# EAGLE design light_v2 (EAGLE 7.2.0)
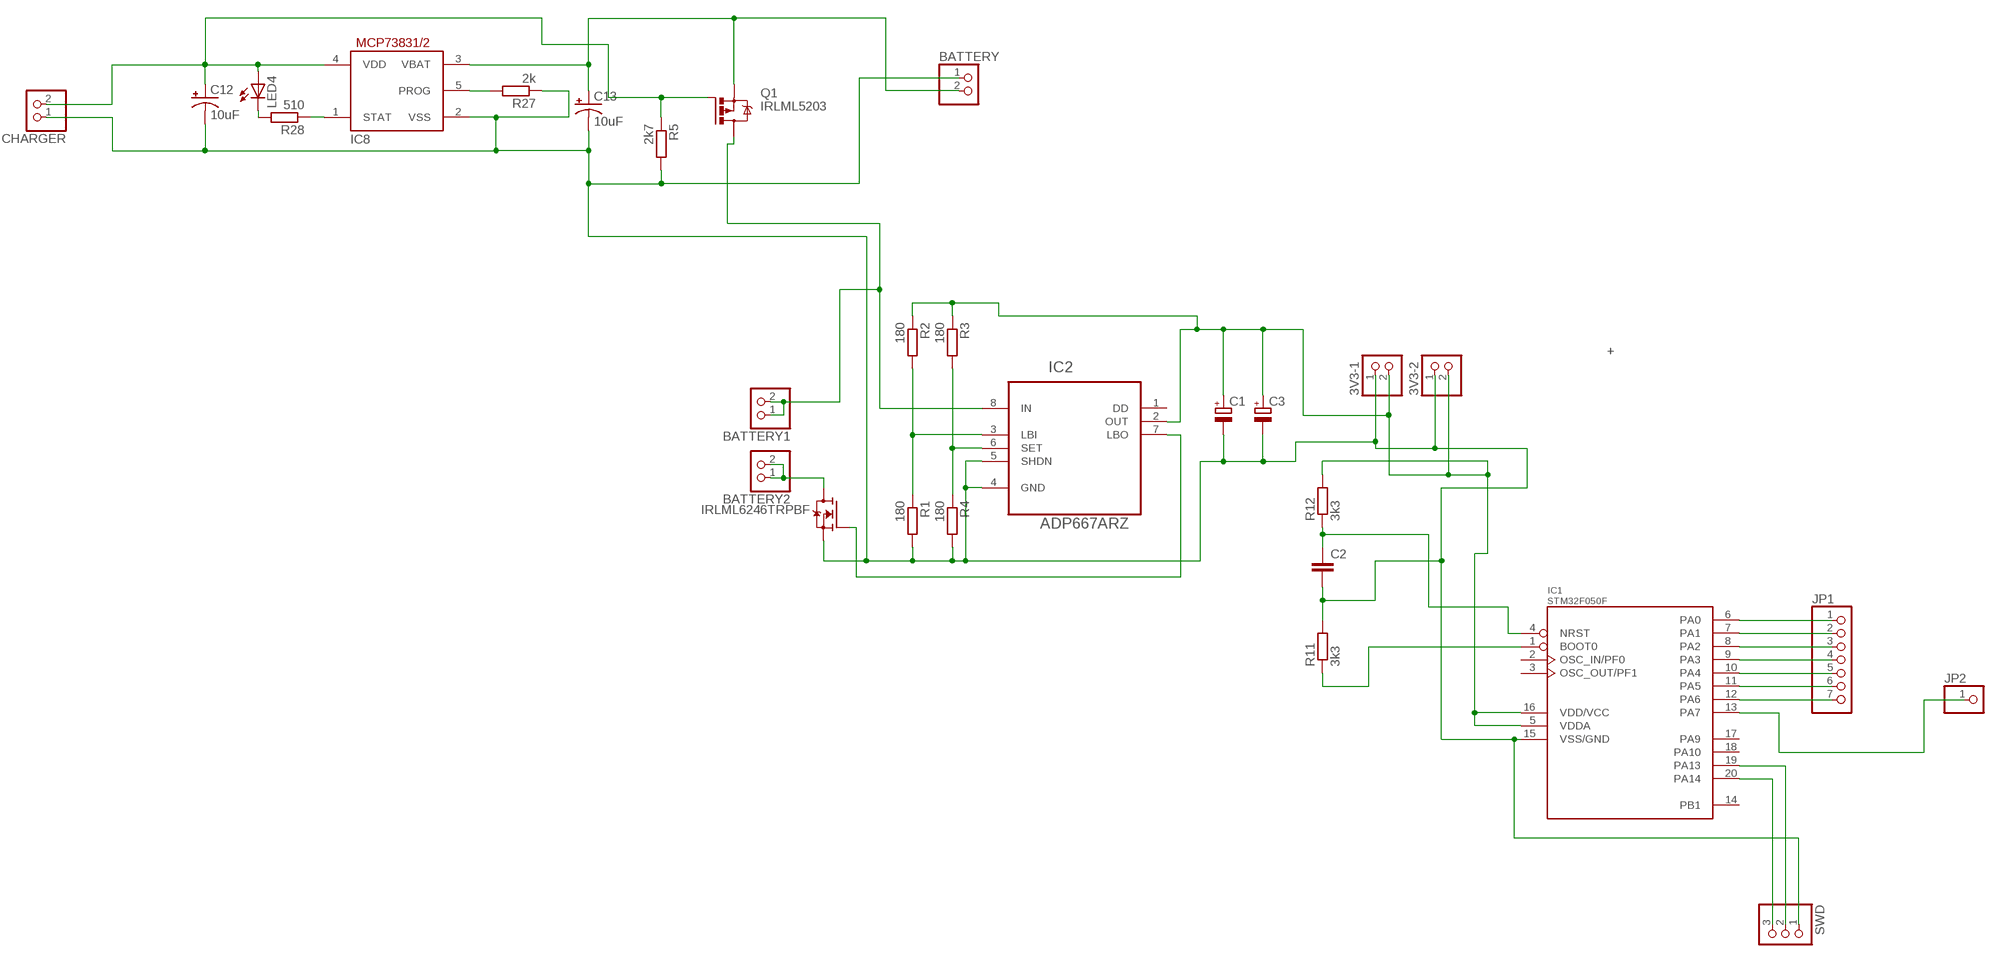
[diagram p0: schematic, sheet 1]

## Parts
3V3-1  PINHD-1X2  [1X02]
3V3-2  PINHD-1X2  [1X02]
BATTERY  PINHD-1X2  [1X02]
BATTERY1  PINHD-1X2  [1X02]
BATTERY2  PINHD-1X2  [1X02]
C1  CPOL-EUSMCD  [SMC_D]
C2  C-EUC1206  [C1206]
C3  CPOL-EUSMCD  [SMC_D]
C12  10uF  CPOL-USSMCD  [SMC_D]
C13  10uF  CPOL-USSMCD  [SMC_D]
CHARGER  PINHD-1X2  [1X02]
IC1  STM32F050F  [TSSOP20]
IC2  ADP667ARZ  [SOIC127P600X175-8N]
IC8  MCP73831/OT  [SOT23-5L]
IRLML6246TRPBF  MOSFET-N-SOT23  [SOT23]
JP1  PINHD-1X7  [1X07]
JP2  PINHD-1X1  [1X01]
LED4  LED  [SMARTLED-TTW]
Q1  IRLML5203  [MICRO3]
R1  180  R-EU_M1206  [M1206]
R2  180  R-EU_M1206  [M1206]
R3  180  R-EU_M1206  [M1206]
R4  180  R-EU_M1206  [M1206]
R5  2k7  R-EU_M1206  [M1206]
R11  3k3  R-EU_M1206  [M1206]
R12  3k3  R-EU_M1206  [M1206]
R27  2k  R-EU_M1206  [M1206]
R28  510  R-EU_M1206  [M1206]
SWD  PINHD-1X3  [1X03]

## Nets
N$1: IC1.6(PA0) JP1.1
N$3: IC1.7(PA1) JP1.2
N$4: IC1.8(PA2) JP1.3
N$5: BATTERY1.1 BATTERY1.2 IC2.8(IN) Q1.3(D)
N$6: IC1.9(PA3) JP1.4
N$7: IC1.10(PA4) JP1.5
N$8: IC1.11(PA5) JP1.6
N$9: IC1.12(PA6) JP1.7
N$10: IC1.13(PA7) JP2.1
N$11: BATTERY2.1 BATTERY2.2 IRLML6246TRPBF.3(D)
N$12: IC2.7(LBO) IRLML6246TRPBF.1(G)
N$15: 3V3-1.1 3V3-2.1 BATTERY.1 C1.- C2.2 C3.- C12.- C13.- CHARGER.1 IC1.15(VSS/GND) IC2.4(GND) IC2.5(SHDN) IC8.2(VSS) IRLML6246TRPBF.2(S) R1.2 R4.2 R5.2 R11.2 R27.1 SWD.1
N$16: BATTERY.2 C13.+ IC8.3(VBAT) Q1.2(S)
N$20: IC2.6(SET) R3.2 R4.1
N$22: IC2.3(LBI) R1.1 R2.2
N$31: C2.1 IC1.4(NRST) R12.1
N$32: IC1.1(BOOT0) R11.1
N$34: IC1.19(PA13) SWD.2
N$35: IC1.20(PA14) SWD.3
N$57: C12.+ CHARGER.2 IC8.4(VDD) LED4.A@1(A) Q1.1(G) R5.1
N$66: IC8.5(PROG) R27.2
N$68: IC8.1(STAT) R28.1
N$70: LED4.C@1(C) R28.2
OUT: 3V3-1.2 3V3-2.2 C1.+ C3.+ IC1.5(VDDA) IC1.16(VDD/VCC) IC2.2(OUT) R2.1 R3.1 R12.2
Unconnected: IC1.2(OSC_IN/PF0) IC1.3(OSC_OUT/PF1) IC1.14(PB1) IC1.17(PA9) IC1.18(PA10) IC2.1(DD)

## Notes on the sheet
- +

## Library data of the parts
3V3-1 3V3-2 BATTERY BATTERY1 BATTERY2 CHARGER = pinhead:PINHD-1X2: PIN HEADER
C1 C3 = resistor:CPOL-EU: POLARIZED CAPACITOR, European symbol
C2 = rcl:C-EU: CAPACITOR, European symbol
C12 C13 = rcl:CPOL-US: POLARIZED CAPACITOR, American symbol
IC1 = STM32F050:STM32F050*: STM32F050xxF*
IC2 = Analog Devices_By_element14_Batch_1:ADP667ARZ: Low-Dropout Linear Voltage Regulator; MPN: ADP667ARZ; OC_FARNELL: -; OC_NEWARK: 59K2649; PACKAGE: SOIC-8; SUPPLIER: Analog Devices
IC8 = adafruit:MCP73831: MCP73831/2 Miniature Single-Cell, Fully Integrated Li-Ion, Li-Polymer Charge Management Controllers. Nice and small simple lipoly charge controller, with adjustable current and status output (LED) http://www.ladyada.net/library/pcb/eaglelibrary.html
IRLML6246TRPBF = we-transistor:MOSFET-N: N-Channel MOSFET TSM3404, IRLML2502 (Vgs>=+/-20V, Vds>=20V, Id>=3A + Rds<=0.05Ohm @ Vgs=4.5V) BSS138 (Vgs>=+/-20V, Vds>=40V, Id>=0.2A + Rds<=3Ohm @ Vgs=4.5V)
JP1 = pinhead:PINHD-1X7: PIN HEADER
JP2 = pinhead:PINHD-1X1: PIN HEADER
LED4 = adafruit:LED: LED OSRAM: - CHIPLED LG R971, LG N971, LY N971, LG Q971, LY Q971, LO R971, LY R971 LH N974, LH R974 LS Q976, LO Q976, LY Q976 LO Q996 - Hyper CHIPLED LW Q18S LB Q993, LB Q99A, LB R99A - SideLED LS A670, LO A670, LY A670, LG A670, LP A670 LB A673, LV A673, LT A673, LW A673 LH A674 LY A675 LS A676, LA A676, LO A676, LY A676, LW A676 LS A679, LY A679, LG A679 - Hyper Micro SIDELED® LS Y876, LA Y876, LO Y876, LY Y876 LT Y87S - SmartLED LW L88C, LW L88S LB L89C, LB L89S, LG L890 LS L89K, LO L89K, LY L89K LS L896, LA L896, LO L896, LY L896 - TOPLED LS T670, LO T670, LY T670, LG T670, LP T670 LSG T670, LSP T670, LSY T670, LOP T670, LYG T670 LG T671, LOG T671, LSG T671 LB T673, LV T673, LT T673, LW T673 LH T674 LS T676, LA T676, LO T676, LY T676, LB T676, LH T676, LSB T676, LW T676 LB T67C, LV T67C, LT T67C, LS T67K, LO T67K, LY T67K, LW E67C LS E67B, LA E67B, LO E67B, LY E67B, LB E67C, LV E67C, LT E67C LW T67C LS T679, LY T679, LG T679 LS T770, LO T770, LY T770, LG T770, LP T770 LB T773, LV T773, LT T773, LW T773 LH T774 LS E675, LA E675, LY E675, LS T675 LS T776, LA T776, LO T776, LY T776, LB T776 LHGB T686 LT T68C, LB T68C - Hyper Mini TOPLED® LB M676 - Mini TOPLED Santana® LG M470 LS M47K, LO M47K, LY M47K Source: http://www.osram.convergy.de/
Q1 = transistor-power:IRLML5203: HEXFET P-Channel Power MOSFET
R1-R5 R11 R12 R27 R28 = resistor:R-EU_: RESISTOR, European symbol
SWD = adafruit:PINHD-1X3: PIN HEADER

## Board
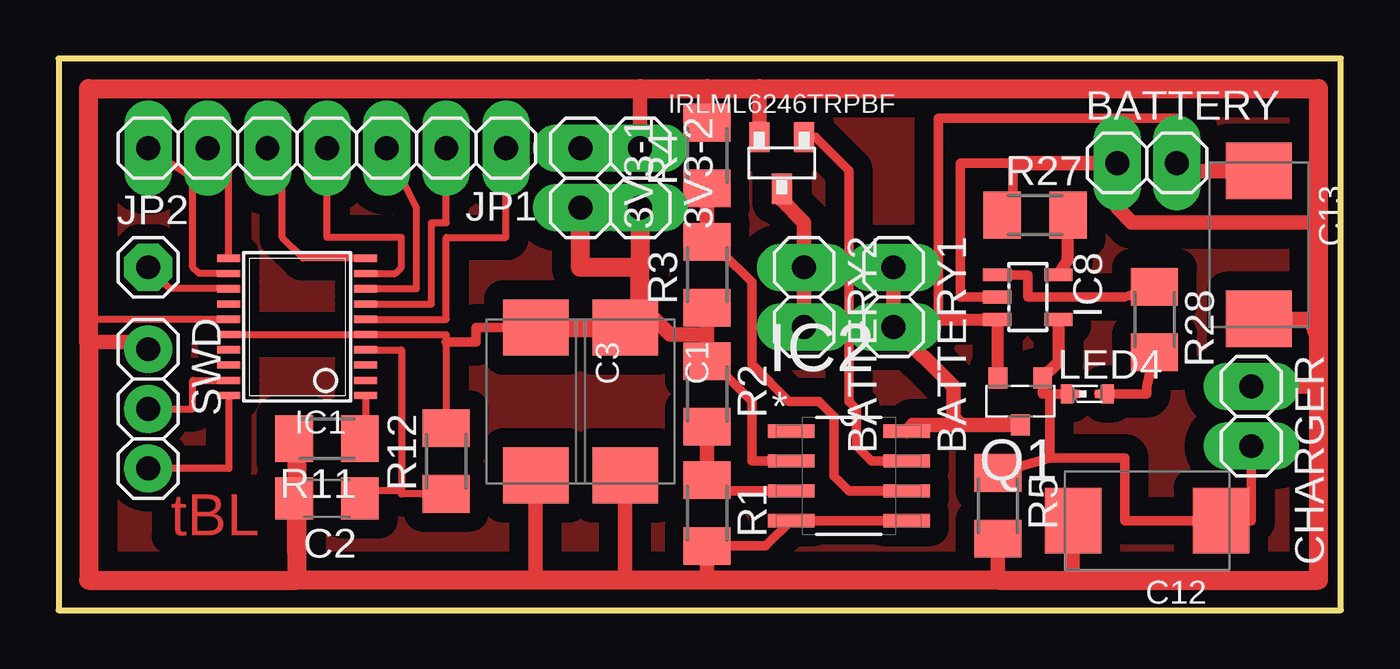
[diagram p1: board, top side]

Size 54.61 x 23.5 mm. Coordinates in mm from the lower left corner, seen from the top.
Outline: 0,0 54.61,0 54.61,23.5 0,23.5 0,0
Copper layers (1*16): Top 0.035mm / dielectric 1.5mm / Bottom 0.035mm
Design rules "default *": minimum track width 10mil, minimum drill 24mil, track to track 8mil, track to pad 8mil, pad to pad 8mil, via to via 8mil, smd to smd 8mil, copper to edge 40mil, drill to drill 8mil, minimum pad ring 20mil, minimum via ring 15mil, stop-mask expansion 4mil, vias tented up to drill 0mil, thermal gap 10mil

### Footprints (pad centres in the part's own frame; a part is rotated, then mirrored left to right if it is on the bottom)
1X02 = drill 1.016 long: 1 -1.27,0; 2 1.27,0
SMC_D = smd 2.4 x 2.8: + -3.15,0; - 3.15,0
C1206 = smd 1.6 x 1.8: 1 -1.4,0; 2 1.4,0
TSSOP20 = smd 0.305 x 0.991: 1 -2.925,-2.918; 2 -2.275,-2.918; 3 -1.625,-2.918; 4 -0.975,-2.918; 5 -0.325,-2.918; 6 0.325,-2.918; 7 0.975,-2.918; 8 1.625,-2.918; 9 2.275,-2.918; 10 2.925,-2.918; 11 2.925,2.918; 12 2.275,2.918; 13 1.625,2.918; 14 0.975,2.918; 15 0.325,2.918; 16 -0.325,2.918; 17 -0.975,2.918; 18 -1.625,2.918; 19 -2.275,2.918; 20 -2.925,2.918
SOIC127P600X175-8N = smd 1.981 x 0.559: 1 -2.464,1.905; 2 -2.464,0.635; 3 -2.464,-0.635; 4 -2.464,-1.905; 5 2.464,-1.905; 6 2.464,-0.635; 7 2.464,0.635; 8 2.464,1.905
SOT23-5L = smd 0.55 x 1.2: 1 -0.95,-1.3; 2 0,-1.3; 3 0.95,-1.3; 4 0.95,1.3; 5 -0.95,1.3
SOT23 = smd 1.3 x 0.9: 1 -1.1,0.95; 2 -1.1,-0.95; 3 1.1,0
1X07 = drill 1.016 long: 1 -7.62,0; 2 -5.08,0; 3 -2.54,0; 4 0,0; 5 2.54,0; 6 5.08,0; 7 7.62,0
1X01 = drill 1.016 octagon: 1 0,0
SMARTLED-TTW = smd 0.8 x 0.5: A 0,-0.875; C 0,0.875 | smd 0.35 x 0.35: A@1 0,-0.5; C@1 0,0.5
MICRO3 = smd 0.8 x 0.9: 1 -0.95,-1; 2 0.95,-1; 3 0,1
M1206 = smd 1.6 x 2: 1 -1.4,0; 2 1.4,0
1X03 = drill 1.016: 1 -2.54,0; 2 0,0; 3 2.54,0

### Placement (x,y rotation side)
3V3-1  22.23,18.41 270 top
3V3-2  24.77,18.41 270 top
BATTERY  46.35,19.05 0 top
BATTERY1  35.56,13.34 270 top
BATTERY2  31.75,13.34 270 top
C1  24.13,8.89 270 top
C2  11.43,4.76 180 top
C3  20.32,8.89 270 top
C12  46.35,3.81 180 top
C13  51.12,15.56 270 top
CHARGER  50.8,8.26 270 top
IC1  10.16,12.06 90 top
IC2  33.66,5.71 0 top
IC8  41.27,13.34 270 top
IRLML6246TRPBF  30.8,19.05 270 top
JP1  11.43,19.68 180 top
JP2  3.81,14.61 0 top
LED4  43.81,9.21 270 top
Q1  40.96,8.89 180 top
R1  27.62,4.13 270 top
R2  27.62,9.21 270 top
R3  27.62,14.29 90 top
R4  27.62,19.37 90 top
R5  40.01,4.45 270 top
R11  11.43,7.3 180 top
R12  16.51,6.35 90 top
R27  41.59,16.83 0 top
R28  46.67,12.38 270 top
SWD  3.81,8.57 270 top

### Tracks (layer width: path | path; a pad name or v marks a point on that pad's centre or on a via)
N$1
  Top 0.305: IC1.6 16.51,12.39 16.51,15.88 19.05,15.88 JP1.1
N$2
  pour Top (isolate 0.813): 0,0 54.61,0.64 54.61,24.13 0,23.5
N$3
  Top 0.305: IC1.7 15.88,13.04 15.88,16.51 16.51,16.51 JP1.2
N$4
  Top 0.305: IC1.8 15.24,13.69 15.24,17.14 JP1.3
N$5
  Top 0.61: Q1.3 38.42,7.89 | 38.42,7.89 36.39,7.89 IC2.8 | BATTERY1.1 BATTERY1.2 38.1,9.53 38.1,8.21 38.42,7.89
N$6
  Top 0.305: IC1.9 14.34,14.34 14.61,14.61 14.61,15.88 11.43,15.88 JP1.4
N$7
  Top 0.305: IC1.10 10.41,14.99 9.53,15.88 9.53,18.41 JP1.5
N$8
  Top 0.305: 7.3,14.99 IC1.11 7.24,18.67 JP1.6
N$9
  Top 0.305: IC1.12 5.98,14.34 5.71,14.61 5.71,18.41 JP1.7
N$10
  Top 0.305: IC1.13 4.72,13.69 JP2.1
N$11
  Top 0.61: IRLML6246TRPBF.3 30.8,17.46 31.75,16.51 BATTERY2.1 BATTERY2.2
N$12
  Top 0.406: IRLML6246TRPBF.1 32.24,20.15 33.66,18.73 33.66,8.89 33.97,8.57 33.97,6.99 34.61,6.35 IC2.7
N$15
  Top 0.305: IC1.15 1.27,12.39 1.27,12.06
  Top 0.406: IC8.2 38.42,13.34 38.42,19.05 40.64,19.05 40.64,16.83 R27.1 | R1.2 30.11,2.73 IC2.4 IC2.5
  Top 0.61: SWD.1 3.81,11.43 1.27,11.43 | C2.2 10.03,2.54 10.16,1.27 | C3.- 20.32,1.27 | C1.- 24.13,1.27 | R5.2 40.01,1.27 | C12.- 43.18,2.86 43.18,1.27 | CHARGER.1 53.66,9.53 | 3V3-2.1 24.77,22.23 | R4.2 27.62,22.23 | R1.2 27.62,1.27 | IRLML6246TRPBF.2 29.84,22.23 | C13.- 53.31,12.41 53.66,11.43 | 53.66,16.51 45.72,16.51 45.09,17.14 BATTERY.1 40.64,19.05
  Top 0.813: 10.16,1.27 20.32,1.27 24.13,1.27 27.62,1.27 40.01,1.27 43.18,1.27 53.66,1.27 53.66,9.53 53.66,11.43 53.66,16.51 53.66,22.23 29.84,22.23 27.62,22.23 24.77,22.23 1.27,22.23 1.27,12.06 1.27,11.43 1.27,1.27 10.16,1.27 | 10.16,1.27 10.16,7.3 R11.2 | 3V3-2.1 3V3-1.1
N$16
  Top 0.406: 37.47,12.38 37.47,20.95 47.62,20.95 BATTERY.2
  Top 0.508: 37.47,12.38 IC8.3 39.98,9.92 Q1.2
  Top 0.61: C13.+ 48.6,18.71 BATTERY.2
N$20
  Top 0.406: R3.2 28.07,15.24 28.26,15.24 29.53,13.97 29.53,10.48 31.11,8.89 32.38,8.89 33.02,8.26 33.02,5.71 33.66,5.08 IC2.6
  Top 0.61: R4.1 R3.2
N$22
  Top 0.406: R1.1 27.62,5.08 IC2.3
  Top 0.61: R1.1 R2.2 28.07,7.81 28.26,7.62
N$31
  Top 0.305: IC1.4 14.61,11.09 14.61,5.08 | 14.61,5.08 12.83,5.08 C2.1 | R12.1 14.61,4.95 14.61,5.08
N$32
  Top 0.305: 13.08,7.69 R11.1 13.08,7.3 IC1.1
N$34
  Top 0.305: SWD.2 5.71,8.57 5.71,9.79 IC1.19
N$35
  Top 0.305: IC1.20 7.24,6.03 SWD.3
N$57
  Top 0.406: 41.91,9.85 Q1.1 41.91,9.21 42.23,9.21 | R5.1 42.23,6.48 | CHARGER.2 50.8,3.81 C12.+ 45.4,3.81 45.4,6.48 42.23,6.48 | LED4.A@1 42.23,9.21 | 42.23,6.48 42.23,9.21
  Top 0.508: IC8.4 42.58,10.56 Q1.1
N$66
  Top 0.508: IC8.5 42.99,14.92 R27.2
N$68
  Top 0.406: IC8.1 41.27,14.29 41.27,13.34 45.4,13.34 R28.1
N$70
  Top 0.406: LED4.C@1 46.35,9.21 46.35,9.53 R28.2
OUT
  Top 0.305: IC1.16 IC1.5 16.51,11.74 16.51,11.43 R12.2
  Top 0.406: C3.+ 17.78,12.04 17.78,11.43 16.51,11.43 | IC2.2 29.53,6.35 29.53,8.89 27.81,10.61 R2.1
  Top 0.61: 24.77,12.7 25.08,12.7 26.04,11.75 27.62,11.75 | 27.62,11.75 R3.1 | R2.1 27.62,11.75
  Top 0.813: C3.+ C1.+ 24.77,12.7 24.77,14.61 | 24.77,14.61 22.23,14.61 3V3-1.2 | 3V3-2.2 24.77,14.61

### Text on the board
Top: tBL
Document: - | - | BAT_OUT | - | + | 6 | 5 | 4 | 3 | 2 | 1 | 0 | + | - | + | + | BAT | L | 3V3 | G | - | + | - | IO | + | CK | CHARGER | CRG | CONT / ROLLER | STAB / ILIZER